# EAGLE schematic schema (EAGLE 9.6.2)
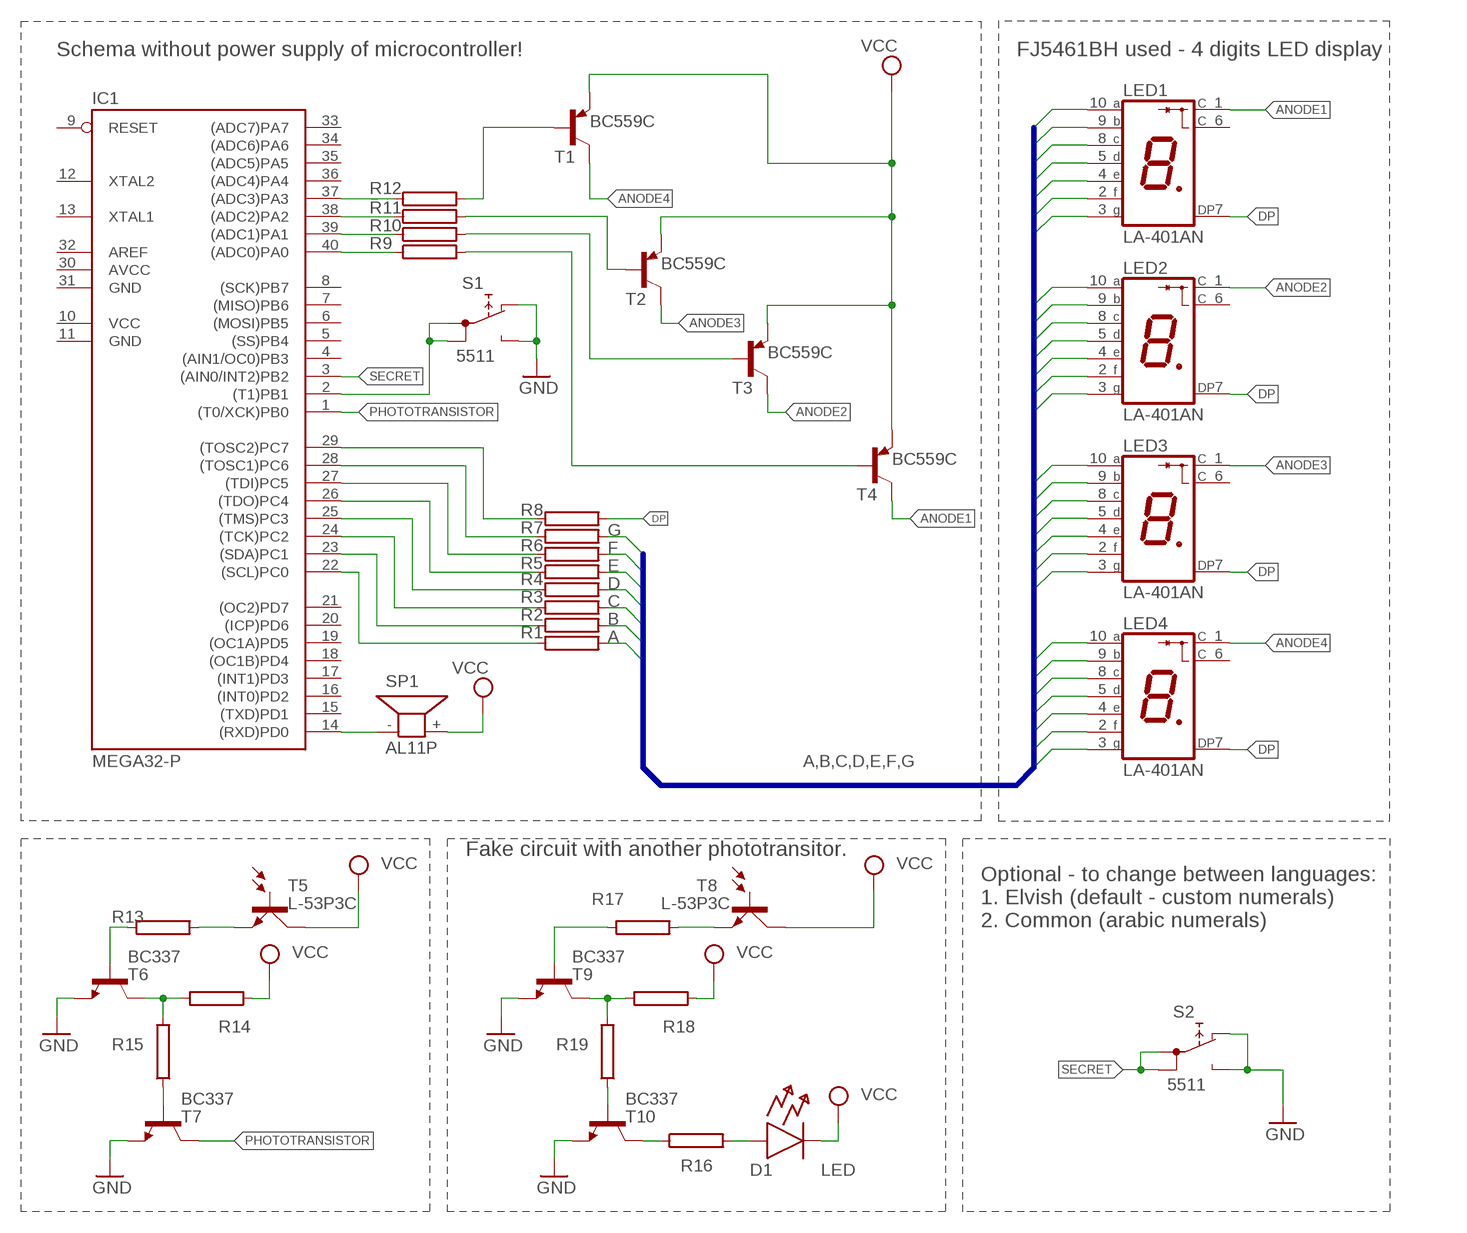
[diagram p0: schematic, sheet 1]

## Parts
D1  LED  (no package)
IC1  MEGA32-P  [DIL40]
LED1  LA-401AN  [LA-401]
LED2  LA-401AN  [LA-401]
LED3  LA-401AN  [LA-401]
LED4  LA-401AN  [LA-401]
R1  100R  RAC01  [AC01]
R2  100R  RAC01  [AC01]
R3  100R  RAC01  [AC01]
R4  100R  RAC01  [AC01]
R5  100R  RAC01  [AC01]
R6  100R  RAC01  [AC01]
R7  100R  RAC01  [AC01]
R8  100R  RAC01  [AC01]
R9  2.2k  RAC01  [AC01]
R10  2.2k  RAC01  [AC01]
R11  2.2k  RAC01  [AC01]
R12  2.2k  RAC01  [AC01]
R13  2.2k  RAC01  [AC01]
R14  10k  RAC01  [AC01]
R15  2.2k  RAC01  [AC01]
R16  220R  RAC01  [AC01]
R17  2.2k  RAC01  [AC01]
R18  10k  RAC01  [AC01]
R19  2.2k  RAC01  [AC01]
S1  5511  [5511]
S2  5511  [5511]
SP1  AL11P  [AL11P]
T1  BC559C  -PNP-TO92  [TO92]
T2  BC559C  -PNP-TO92  [TO92]
T3  BC559C  -PNP-TO92  [TO92]
T4  BC559C  -PNP-TO92  [TO92]
T5  L-53P3C  BP103  [BP103]
T6  BC337  2N2405  [TO5]
T7  BC337  2N2405  [TO5]
T8  L-53P3C  BP103  [BP103]
T9  BC337  2N2405  [TO5]
T10  BC337  2N2405  [TO5]

## Nets
A: LED1.10(A) LED2.10(A) LED3.10(A) LED4.10(A) R1.2
ANODE1: LED1.1(C) T4.3(C)
ANODE2: LED2.1(C) T3.3(C)
ANODE3: LED3.1(C) T2.3(C)
ANODE4: LED4.1(C) T1.3(C)
B: LED1.9(B) LED2.9(B) LED3.9(B) LED4.9(B) R2.2
C: LED1.8(C) LED2.8(C) LED3.8(C) LED4.8(C) R3.2
D: LED1.5(D) LED2.5(D) LED3.5(D) LED4.5(D) R4.2
DP: LED1.7(DP) LED2.7(DP) LED3.7(DP) LED4.7(DP) R8.2
E: LED1.4(E) LED2.4(E) LED3.4(E) LED4.4(E) R5.2
F: LED1.2(F) LED2.2(F) LED3.2(F) LED4.2(F) R6.2
G: LED1.3(G) LED2.3(G) LED3.3(G) LED4.3(G) R7.2
GND: S1.NC S1.NO S2.NC S2.NO T6.1(E) T7.1(E) T9.1(E) T10.1(E)
N$1: IC1.29((TOSC2)PC7) R8.1
N$2: IC1.28((TOSC1)PC6) R7.1
N$3: IC1.27((TDI)PC5) R6.1
N$4: IC1.26((TDO)PC4) R5.1
N$5: IC1.25((TMS)PC3) R4.1
N$6: IC1.24((TCK)PC2) R3.1
N$7: IC1.23((SDA)PC1) R2.1
N$8: IC1.22((SCL)PC0) R1.1
N$9: IC1.40((ADC0)PA0) R9.1
N$10: IC1.39((ADC1)PA1) R10.1
N$11: IC1.38((ADC2)PA2) R11.1
N$12: IC1.37((ADC3)PA3) R12.1
N$13: R11.2 T2.2(B)
N$14: R12.2 T1.2(B)
N$15: R10.2 T3.2(B)
N$16: R9.2 T4.2(B)
N$17: R13.2 T5.E
N$18: R13.1 T6.2(B)
N$19: R17.1 T9.2(B)
N$20: R15.1 T7.2(B)
N$21: IC1.14((RXD)PD0) SP1.-
N$22: IC1.2((T1)PB1) S1.1A S1.1B
N$23: R14.2 R15.2 T6.3(C)
N$24: R17.2 T8.E
N$25: R16.1 T10.3(C)
N$26: R18.2 R19.2 T9.3(C)
N$27: D1.A R16.2
N$28: R19.1 T10.2(B)
PHOTOTRANSISTOR: IC1.1((T0/XCK)PB0) T7.3(C)
SECRET: IC1.3((AIN0/INT2)PB2) S2.1A S2.1B
VCC: D1.C R14.1 R18.1 SP1.+ T1.1(E) T2.1(E) T3.1(E) T4.1(E) T5.C T8.C
Unconnected: IC1.4((AIN1/OC0)PB3) IC1.5((SS)PB4) IC1.6((MOSI)PB5) IC1.7((MISO)PB6) IC1.8((SCK)PB7) IC1.9(RESET) IC1.12(XTAL2) IC1.13(XTAL1) IC1.15((TXD)PD1) IC1.16((INT0)PD2) IC1.17((INT1)PD3) IC1.18((OC1B)PD4) IC1.19((OC1A)PD5) IC1.20((ICP)PD6) IC1.21((OC2)PD7) IC1.32(AREF) IC1.33((ADC7)PA7) IC1.34((ADC6)PA6) IC1.35((ADC5)PA5) IC1.36((ADC4)PA4) LED1.6(C) LED2.6(C) LED3.6(C) LED4.6(C) T5.B T8.B

## Buses
A,B,C,D,E,F,G

## Notes on the sheet
- Schema without power supply of microcontroller! | FJ5461BH used - 4 digits LED display
- Fake circuit with another phototransitor.
- Optional - to change between languages:
  1. Elvish (default - custom numerals)
  2. Common (arabic numerals)

## Power pins joined to a net without a drawn wire
AVCC: IC1.30(AVCC)
GND: IC1.11(GND) IC1.31(GND)
VCC: IC1.10(VCC)

## Library data of the parts
D1 = ngspice-simulation:LED: Diode
IC1 = atmel:MEGA32-P: MICROCONTROLLER 32 Kbytes FLASH 2 Kbytes SRAM 1 Kbytes EEPROM USART 8-channel 10 bit ADC Source: www.atmel.com .. doc2503.pdf; MPN: ATMEGA32-16PU; OC_FARNELL: 1661729; OC_NEWARK: 51P1794
LED1-LED4 = led-7-segment:LA-401*N: Single Digit LED Numeric Display (cathode common) Source: ROHM .. la-1401dn.pdf; OC_FARNELL: unknown; OC_NEWARK: unknown
R1-R19 = resistor-power:R: Power Resitor; OC_FARNELL: unknown; OC_NEWARK: unknown
S1 S2 = switch:55?: PUSHBUTTON SERIES 5500 SWITCHES Source: www.e-switch.com .. 5500.pdf
SP1 = buzzer:AL11P: SPEAKER Source: Buerklin; OC_FARNELL: unknown; OC_NEWARK: unknown
T1-T4 = transistor:*-PNP-: PNP Transistror
T5 T8 = opto-trans-siemens:BP103: PHOTO TRANSISTOR; OC_FARNELL: unknown; OC_NEWARK: unknown
T6 T7 T9 T10 = transistor:2N2405: NPN TRANSISTOR